# EAGLE design attiny_dev_board (EAGLE 9.6.2)
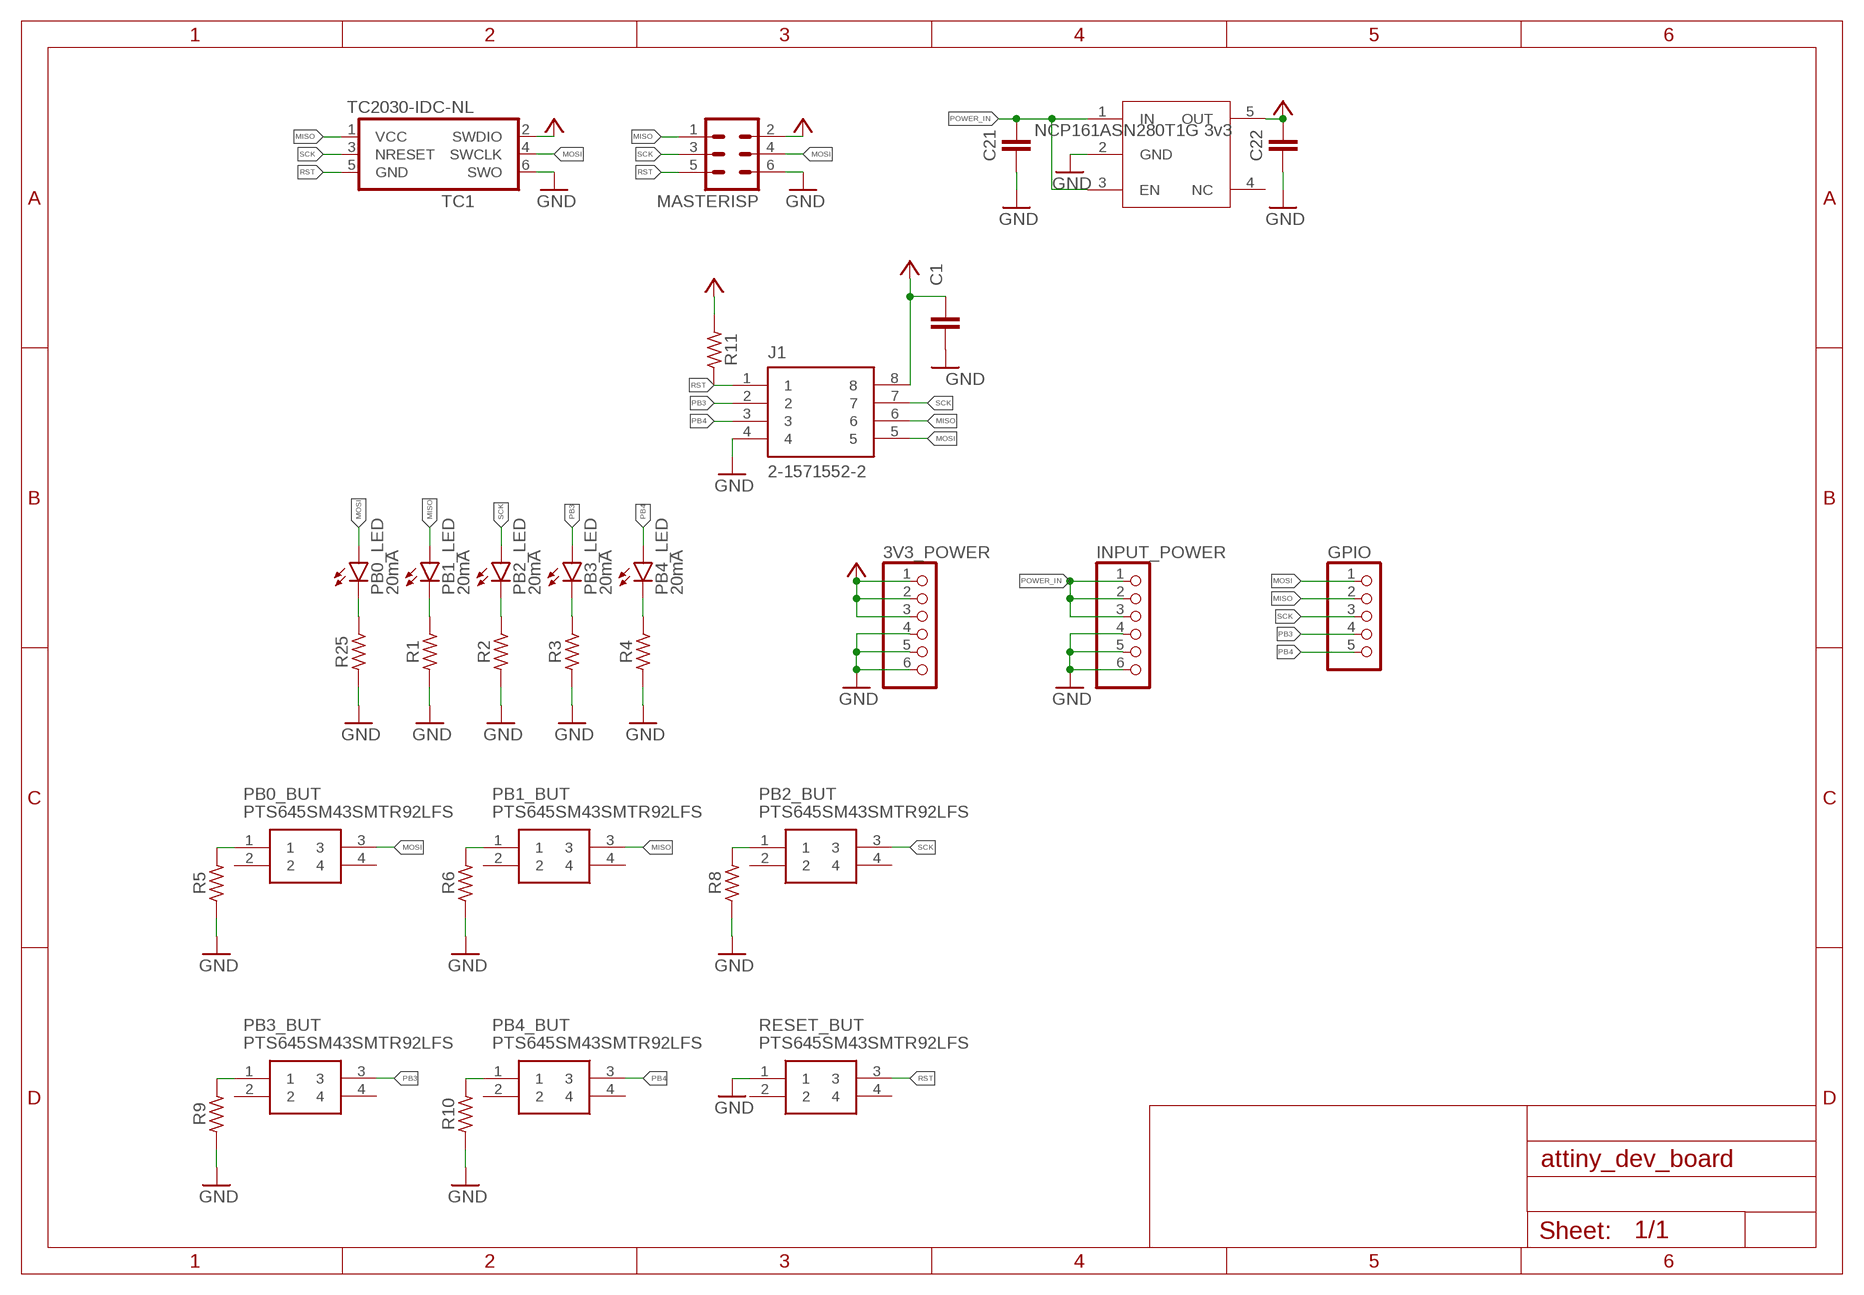
[diagram p0: schematic, sheet 1]

## Parts
3V3_POWER  PINHD-1X6  [1X06]
3V3_REG1  3V3  NCP718BSN330T1G  [NCP718BSN330T1G]
C1  0.1uF  C-EUC0603  [C0603]
C21  1uF  C-EUC0603  [C0603]
C22  1uF  C-EUC0603  [C0603]
GPIO  PINHD-1X5  [1X05]
INPUT_POWER  PINHD-1X6  [1X06]
J1  2-1571552-2  [TE_2-1571552-2]
MASTERISP  5v  MA03-2-3D  [MA03-2]
PB0_BUT  PTS645SM43SMTR92LFS  [PTS645(SMT)]
PB0_LED  20mA  LEDCHIP-LED0603  [CHIP-LED0603]
PB1_BUT  PTS645SM43SMTR92LFS  [PTS645(SMT)]
PB1_LED  20mA  LEDCHIP-LED0603  [CHIP-LED0603]
PB2_BUT  PTS645SM43SMTR92LFS  [PTS645(SMT)]
PB2_LED  20mA  LEDCHIP-LED0603  [CHIP-LED0603]
PB3_BUT  PTS645SM43SMTR92LFS  [PTS645(SMT)]
PB3_LED  20mA  LEDCHIP-LED0603  [CHIP-LED0603]
PB4_BUT  PTS645SM43SMTR92LFS  [PTS645(SMT)]
PB4_LED  20mA  LEDCHIP-LED0603  [CHIP-LED0603]
R1  1k  52101-101-REV-A_RC-MASTER-SMD_R_0603MP  [52101-101-REV-A_RC-MASTER-SMD_R0603MP]
R2  1k  52101-101-REV-A_RC-MASTER-SMD_R_0603MP  [52101-101-REV-A_RC-MASTER-SMD_R0603MP]
R3  1k  52101-101-REV-A_RC-MASTER-SMD_R_0603MP  [52101-101-REV-A_RC-MASTER-SMD_R0603MP]
R4  1k  52101-101-REV-A_RC-MASTER-SMD_R_0603MP  [52101-101-REV-A_RC-MASTER-SMD_R0603MP]
R5  20R  52101-101-REV-A_RC-MASTER-SMD_R_0603MP  [52101-101-REV-A_RC-MASTER-SMD_R0603MP]
R6  20R  52101-101-REV-A_RC-MASTER-SMD_R_0603MP  [52101-101-REV-A_RC-MASTER-SMD_R0603MP]
R8  20R  52101-101-REV-A_RC-MASTER-SMD_R_0603MP  [52101-101-REV-A_RC-MASTER-SMD_R0603MP]
R9  20R  52101-101-REV-A_RC-MASTER-SMD_R_0603MP  [52101-101-REV-A_RC-MASTER-SMD_R0603MP]
R10  20R  52101-101-REV-A_RC-MASTER-SMD_R_0603MP  [52101-101-REV-A_RC-MASTER-SMD_R0603MP]
R11  10K  52101-101-REV-A_RC-MASTER-SMD_R_0603MP  [52101-101-REV-A_RC-MASTER-SMD_R0603MP]
R25  1k  52101-101-REV-A_RC-MASTER-SMD_R_0603MP  [52101-101-REV-A_RC-MASTER-SMD_R0603MP]
RESET_BUT  PTS645SM43SMTR92LFS  [PTS645(SMT)]
TC1  TC2030-IDC-NL  [TC2030-IDC-NL]

## Nets
ACTIVITY_LED1: PB1_LED.C R1.2
ACTIVITY_LED2: PB0_LED.C R25.2
ACTIVITY_LED3: PB2_LED.C R2.2
ACTIVITY_LED4: PB3_LED.C R3.2
ACTIVITY_LED5: PB4_LED.C R4.2
GND: 3V3_POWER.4 3V3_POWER.5 3V3_POWER.6 3V3_REG1.2(GND) C1.2 C21.2 C22.2 INPUT_POWER.4 INPUT_POWER.5 INPUT_POWER.6 J1.4 MASTERISP.6 R1.1 R2.1 R3.1 R4.1 R5.1 R6.1 R8.1 R9.1 R10.1 R25.1 RESET_BUT.1 TC1.6(SWO)
MISO: GPIO.2 J1.6 MASTERISP.1 PB1_BUT.3 PB1_LED.A TC1.1(VCC)
MOSI: GPIO.1 J1.5 MASTERISP.4 PB0_BUT.3 PB0_LED.A TC1.4(SWCLK)
N$1: PB0_BUT.1 R5.2
N$2: PB1_BUT.1 R6.2
N$3: PB2_BUT.1 R8.2
N$4: PB3_BUT.1 R9.2
N$5: PB4_BUT.1 R10.2
PB3: GPIO.4 J1.2 PB3_BUT.3 PB3_LED.A
PB4: GPIO.5 J1.3 PB4_BUT.3 PB4_LED.A
POWER_IN: 3V3_REG1.1(IN) 3V3_REG1.3(EN) C21.1 INPUT_POWER.1 INPUT_POWER.2 INPUT_POWER.3
RST: J1.1 MASTERISP.5 R11.2 RESET_BUT.3 TC1.5(GND)
SCK: GPIO.3 J1.7 MASTERISP.3 PB2_BUT.3 PB2_LED.A TC1.3(NRESET)
VCC: 3V3_POWER.1 3V3_POWER.2 3V3_POWER.3 3V3_REG1.5(OUT) C1.1 C22.1 J1.8 MASTERISP.2 R11.1 TC1.2(SWDIO)
Unconnected: 3V3_REG1.4(NC) PB0_BUT.2 PB0_BUT.4 PB1_BUT.2 PB1_BUT.4 PB2_BUT.2 PB2_BUT.4 PB3_BUT.2 PB3_BUT.4 PB4_BUT.2 PB4_BUT.4 RESET_BUT.2 RESET_BUT.4

## Notes on the sheet
- NCP161ASN280T1G 3v3

## Library data of the parts
3V3_POWER INPUT_POWER = pinhead:PINHD-1X6: PIN HEADER
3V3_REG1 = IC-packages_BIG-pack V1.0:NCP718BSN330T1G
C1 C21 C22 = rcl:C-EU: CAPACITOR, European symbol; SPICEPREFIX: C
GPIO = pinhead:PINHD-1X5: PIN HEADER
J1 = 2-1571552-2:2-1571552-2: Row Spacing 2.54 mm Pitch Through Hole Dip Socket Check prices <https://pricing.snapeda.com/parts/2-1571552-2/TE%20Connectivity/view-part?ref=eda>; AVAILABILITY: Warning; COMMENT: 2-1571552-2; CONTACT_CURRENT_RATING_MAX: 3 A; DESCRIPTION: 8 (2 x 4) Pos DIP, 0.3 (7.62mm) Row Spacing Socket Gold Through Hole; EU_ROHS_COMPLIANCE: Compliant; MF: TE Connectivity; MP: 2-1571552-2; PACKAGE: None; PRICE: None; PRODUCT_TYPE: Socket
MASTERISP = con-lstb:MA03-2-3D: PIN HEADER; OC_FARNELL: unknown; OC_NEWARK: unknown
PB0_BUT PB1_BUT PB2_BUT PB3_BUT PB4_BUT RESET_BUT = PTS645SM43SMTR92LFS:PTS645SM43SMTR92LFS: C & K COMPONENTS - PTS645SM43SMTR92LFS - SWITCH, SPST, 0.05A, 12VDC, SMD, 4.3MM Source: Datasheet <http://www.farnell.com/datasheets/1914518.pdf>; DESCRIPTION: C & K COMPONENTS - PTS645SM43SMTR92LFS - SWITCH, SPST, 0.05A, 12VDC, SMD, 4.3MM; HEIGHT: mm; MANUFACTURER_NAME: C & K COMPONENTS; MANUFACTURER_PART_NUMBER: PTS645SM43SMTR92LFS; MOUSER_PART_NUMBER: 611-PTS645SM43SMTR92; MOUSER_PRICE-STOCK: https://www.mouser.com/Search/Refine.aspx?Keyword=611-PTS645SM43SMTR92
PB0_LED PB1_LED PB2_LED PB3_LED PB4_LED = led:LED: LED OSRAM: - CHIPLED LG R971, LG N971, LY N971, LG Q971, LY Q971, LO R971, LY R971 LH N974, LH R974 LS Q976, LO Q976, LY Q976 LO Q996 - Hyper CHIPLED LW Q18S LB Q993, LB Q99A, LB R99A - SideLED LS A670, LO A670, LY A670, LG A670, LP A670 LB A673, LV A673, LT A673, LW A673 LH A674 LY A675 LS A676, LA A676, LO A676, LY A676, LW A676 LS A679, LY A679, LG A679 - Hyper Micro SIDELED® LS Y876, LA Y876, LO Y876, LY Y876 LT Y87S - SmartLED LW L88C, LW L88S LB L89C, LB L89S, LG L890 LS L89K, LO L89K, LY L89K LS L896, LA L896, LO L896, LY L896 - TOPLED LS T670, LO T670, LY T670, LG T670, LP T670 LSG T670, LSP T670, LSY T670, LOP T670, LYG T670 LG T671, LOG T671, LSG T671 LB T673, LV T673, LT T673, LW T673 LH T674 LS T676, LA T676, LO T676, LY T676, LB T676, LH T676, LSB T676, LW T676 LB T67C, LV T67C, LT T67C, LS T67K, LO T67K, LY T67K, LW E67C LS E67B, LA E67B, LO E67B, LY E67B, LB E67C, LV E67C, LT E67C LW T67C LS T679, LY T679, LG T679 LS T770, LO T770, LY T770, LG T770, LP T770 LB T773, LV T773, LT T773, LW T773 LH T774 LS E675, LA E675, LY E675, LS T675 LS T776, LA T776, LO T776, LY T776, LB T776 LHGB T686 LT T68C, LB T68C - Hyper Mini TOPLED® LB M676 - Mini TOPLED Santana® LG M470 LS M47K, LO M47K, LY M47K Source: http://www.osram.convergy.de LUXEON: - LUMILED® LXK2-PW12-R00, LXK2-PW12-S00, LXK2-PW14-U00, LXK2-PW14-V00 LXK2-PM12-R00, LXK2-PM12-S00, LXK2-PM14-U00 LXK2-PE12-Q00, LXK2-PE12-R00, LXK2-PE12-S00, LXK2-PE14-T00, LXK2-PE14-U00 LXK2-PB12-K00, LXK2-PB12-L00, LXK2-PB12-M00, LXK2-PB14-N00, LXK2-PB14-P00, LXK2-PB14-Q00 LXK2-PR12-L00, LXK2-PR12-M00, LXK2-PR14-Q00, LXK2-PR14-R00 LXK2-PD12-Q00, LXK2-PD12-R00, LXK2-PD12-S00 LXK2-PH12-R00, LXK2-PH12-S00 LXK2-PL12-P00, LXK2-PL12-Q00, LXK2-PL12-R00 Source: www.luxeon.com KINGBRIGHT: KA-3528ASYC Source: www.kingbright.com
R1-R6 R8-R11 R25 = ESP32_DMX_Audio:52101-101-REV-A_RC-MASTER-SMD_R_: RESISTOR
TC1 = TC2030-IDC:TC2030-IDC: Tag-Connect In Circuit Programming & Debug Cable 6 Pin http://www.tag-connect.com Check prices <https://pricing.snapeda.com/parts/TC2030-IDC/Tag-Connect%20LLC/view-part?ref=eda>; AVAILABILITY: Warning; DESCRIPTION: Plug-Of-Nails™ Adapter Cable; MF: Tag-Connect LLC; MP: TC2030-IDC; PACKAGE: None; PRICE: None; PURCHASE-URL: https://pricing.snapeda.com/search/part/TC2030-IDC/?ref=eda

## Board
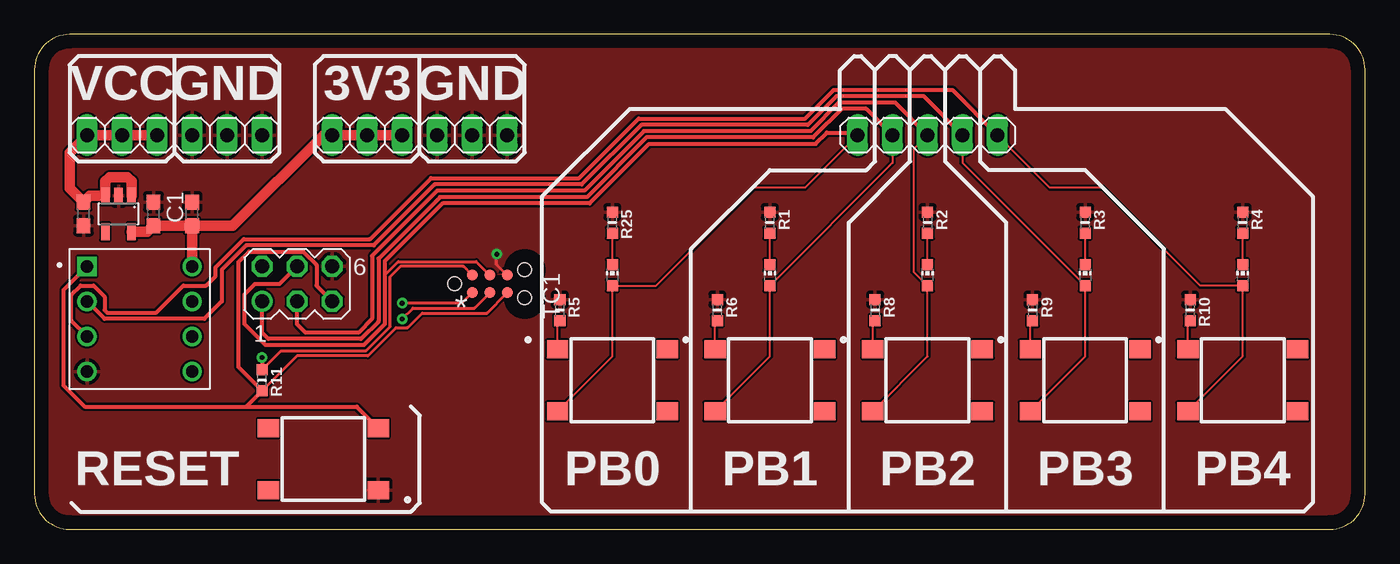
[diagram p1: board, top side]
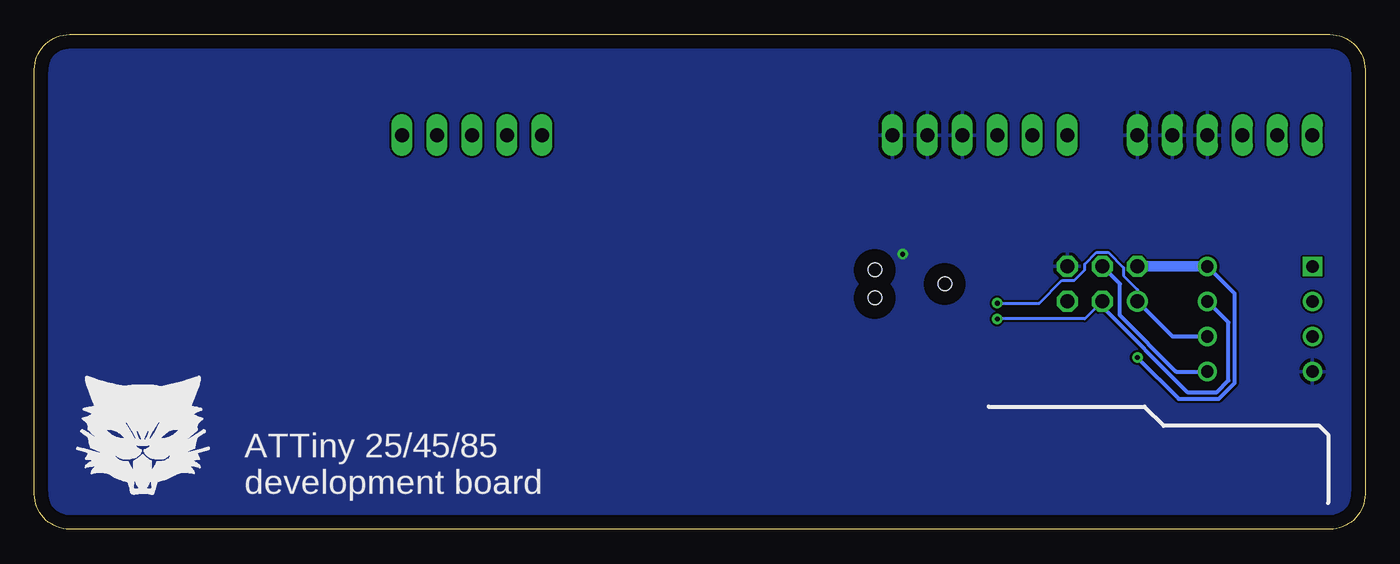
[diagram p2: board, bottom side, seen from below]

Size 96.5 x 35.87 mm. Coordinates in mm from the lower left corner, seen from the top.
Outline: 93.96,35.87 2.54,35.87 arc90 0,33.33 0,2.54 arc90 2.54,0 93.96,0 arc90 96.5,2.54 96.5,33.33 arc90 93.96,35.87
Copper layers (1*16): Top 0.035mm / dielectric 1.5mm / Bottom 0.035mm
Design rules "default": minimum track width 6mil, minimum drill 0.35mm, track to track 6mil, track to pad 6mil, pad to pad 6mil, via to via 6mil, smd to smd 6mil, copper to edge 40mil, drill to drill 6mil, minimum pad ring 10mil, minimum via ring 8mil, stop-mask expansion 4mil, vias tented up to drill 0mil, thermal gap 10mil

### Footprints (pad centres in the part's own frame; a part is rotated, then mirrored left to right if it is on the bottom)
1X06 = drill 1.016 long: 1 -6.35,0; 2 -3.81,0; 3 -1.27,0; 4 1.27,0; 5 3.81,0; 6 6.35,0
NCP718BSN330T1G = smd 0.62 x 1.22: 1 -0.95,-1.3; 2 0,-1.3; 3 0.95,-1.3; 4 0.95,1.3; 5 -0.95,1.3
C0603 = smd 1.1 x 1: 1 -0.85,0; 2 0.85,0
1X05 = drill 1.016 long: 1 -5.08,0; 2 -2.54,0; 3 0,0; 4 2.54,0; 5 5.08,0
TE_2-1571552-2 = drill 0.889 square: 1 -3.81,3.81 | drill 0.889: 2 -3.81,1.27; 3 -3.81,-1.27; 4 -3.81,-3.81; 5 3.81,-3.81; 6 3.81,-1.27; 7 3.81,1.27; 8 3.81,3.81
MA03-2 = drill 1.016: 1 -2.54,-1.27 | drill 1.016 octagon: 2 -2.54,1.27; 3 0,-1.27; 4 0,1.27; 5 2.54,-1.27; 6 2.54,1.27
PTS645(SMT) = smd 1.55 x 1.3: 1 -3.975,2.25; 2 3.975,2.25; 3 -3.975,-2.25; 4 3.975,-2.25
CHIP-LED0603 = smd 0.8 x 0.8: A 0,-0.75; C 0,0.75
52101-101-REV-A_RC-MASTER-SMD_R0603MP = smd 0.8 x 0.8: 1 -0.762,0; 2 0.762,0
TC2030-IDC-NL = smd 0.787 x 0.787: 1 -1.27,-0.635; 2 -1.27,0.635; 3 0,-0.635; 4 0,0.635; 5 1.27,-0.635; 6 1.27,0.635 | hole 0.991: -2.54,0; 2.54,1.016; 2.54,-1.016

### Placement (x,y rotation side)
3V3_POWER  27.94,28.57 0 top
3V3_REG1  6.1,22.86 180 top
C1  11.43,22.86 90 top
C21  3.56,22.86 270 top
C22  8.64,22.86 90 top
GPIO  64.77,28.57 0 top
INPUT_POWER  10.16,28.57 0 top
J1  7.62,15.24 0 top
MASTERISP  19.05,17.78 0 top
PB0_BUT  41.91,10.79 0 top
PB0_LED  41.91,18.41 0 top
PB1_BUT  53.34,10.79 0 top
PB1_LED  53.34,18.41 0 top
PB2_BUT  64.77,10.79 0 top
PB2_LED  64.77,18.41 0 top
PB3_BUT  76.2,10.79 0 top
PB3_LED  76.2,18.41 0 top
PB4_BUT  87.63,10.79 0 top
PB4_LED  87.63,18.41 0 top
R1  53.34,22.23 270 top
R2  64.77,22.23 270 top
R3  76.2,22.23 270 top
R4  87.63,22.23 270 top
R5  38.1,15.88 270 top
R6  49.53,15.88 270 top
R8  60.96,15.88 270 top
R9  72.39,15.88 270 top
R10  83.82,15.88 270 top
R11  16.51,10.79 270 top
R25  41.91,22.23 270 top
RESET_BUT  20.95,5.08 180 top
TC1  33.02,17.78 0 top

### Tracks (layer width: path | path; a pad name or v marks a point on that pad's centre or on a via)
ACTIVITY_LED1
  Top 0.152: PB1_LED.C R1.2
ACTIVITY_LED2
  Top 0.152: PB0_LED.C R25.2
ACTIVITY_LED3
  Top 0.152: PB2_LED.C R2.2
ACTIVITY_LED4
  Top 0.152: PB3_LED.C R3.2
ACTIVITY_LED5
  Top 0.152: PB4_LED.C R4.2
GND  (via drill 0.35)
  Top 0.203: TC1.6 33.53,19.18 v33.53,19.94
  pour Top: -5.08,40.01 99.06,40.01 99.06,-2.54 -5.08,-2.54
  pour Bottom: -5.08,40.01 99.06,40.01 101.6,37.47 101.6,0 99.06,-2.54 -5.08,-2.54
MISO  (via drill 0.35)
  Top 0.152: PB1_BUT.3 53.34,12.52 PB1_LED.A 62.23,26.55 GPIO.2
  Top 0.203: TC1.1 30.99,16.38 v26.67,16.38
  Top 0.305: MASTERISP.1 16.51,14.24 16.95,13.79 23.69,13.79 24.94,15.05 24.94,19.62 29.4,24.08 40.07,24.08 44.39,28.4 56.46,28.4 58.55,30.48 60.33,30.48 GPIO.2
  Bottom 0.203: v26.67,16.38 23.62,16.38 21.97,18.03 21.08,18.03 20.32,18.8 20.32,19.22 19.47,20.07 18.63,20.07 17.53,18.96 17.53,18.38 16.51,17.36 MASTERISP.1
  Bottom 0.305: MASTERISP.1 13.97,13.97 J1.6
MOSI
  Top 0.152: PB0_BUT.3 41.91,12.52 PB0_LED.A 45.09,17.66 52.19,24.77 55.88,24.77 GPIO.1
  Top 0.203: 25.4,18.41 26.39,19.41 32.03,19.41 TC1.4
  Top 0.305: MASTERISP.4 17.78,17.78 16,17.78 15.24,17.02 15.24,14.86 16.76,13.34 23.88,13.34 25.4,14.86 25.4,18.41 25.4,19.43 29.59,23.62 40.26,23.62 44.58,27.94 56.65,27.94 57.47,28.75 59.05,28.75 59.23,28.57 GPIO.1
  Bottom 0.305: MASTERISP.4 17.78,17.78 17.78,15.49 13.72,11.43 J1.5
N$1
  Top 0.152: PB0_BUT.1 37.94,14.95 R5.2
N$2
  Top 0.152: PB1_BUT.1 49.37,14.95 R6.2
N$3
  Top 0.152: PB2_BUT.1 60.8,14.95 R8.2
N$4
  Top 0.152: PB3_BUT.1 72.22,14.95 R9.2
N$5
  Top 0.152: PB4_BUT.1 83.66,14.95 R10.2
PB3
  Top 0.152: PB3_BUT.3 76.2,12.52 PB3_LED.A 67.31,26.55 GPIO.4
  Top 0.305: GPIO.4 64.49,31.39 58.17,31.39 56.09,29.31 44.01,29.31 39.69,24.99 29.02,24.99 24.6,20.57 15.37,20.57 13.59,18.8 13.59,16.51 12.32,15.24 5.08,15.24 J1.2
PB4
  Top 0.152: PB4_BUT.3 87.63,12.52 PB4_LED.A 84.57,17.66 77.47,24.77 73.66,24.77 GPIO.5
  Top 0.305: GPIO.5 66.57,31.85 57.98,31.85 55.9,29.77 43.82,29.77 39.5,25.45 28.75,25.45 24.33,21.03 15.18,21.03 13.13,18.98 13.13,18.34 12.45,17.65 10.79,17.65 8.84,15.7 5.27,15.7 5.08,15.89 5.08,16.86 4.28,17.65 3.34,17.65 2.67,16.98 2.67,15.11 J1.3
POWER_IN
  Top 0.762: INPUT_POWER.3 INPUT_POWER.2 INPUT_POWER.1 2.54,27.3 2.54,24.73 C21.1 4.01,24.16 3V3_REG1.3 5.15,25.21 5.46,25.53 6.73,25.53 7.05,25.21 3V3_REG1.1
RST
  Top 0.203: TC1.5 32.82,15.67 28.12,15.67 27.05,14.61 26.22,14.61 24.19,12.57 19.05,12.57 R11.2
  Top 0.305: MASTERISP.5 20.45,17.65 20.45,19.16 19.49,20.12 15.56,20.12 14.78,19.34 14.78,11.76 R11.2 15.37,8.89 | RESET_BUT.3 23.37,8.89 15.37,8.89 | 15.37,8.89 3.63,8.89 2.11,10.41 2.11,17.35 J1.1
SCK  (via drill 0.35)
  Top 0.152: PB2_BUT.3 64.77,12.52 PB2_LED.A 63.75,18.68 63.75,27.56 GPIO.3
  Top 0.203: v26.67,15.24 27.46,16.03 31.9,16.03 32.92,17.04 | 32.92,17.04 33.02,17.04 | TC1.3 32.92,17.04
  Top 0.305: MASTERISP.3 19.05,14.86 19.66,14.25 23.5,14.25 24.49,15.24 24.49,19.81 29.21,24.54 39.88,24.54 44.2,28.85 56.27,28.85 58.36,30.94 62.41,30.94 GPIO.3
  Bottom 0.203: MASTERISP.3 20.32,15.24 v26.67,15.24
  Bottom 0.305: MASTERISP.3 19.05,16.12 12.84,9.91 10.79,9.91 9.91,10.79 9.91,14.99 J1.7
VCC  (via drill 0.35)
  Top 0.203: TC1.2 31.11,19.05 26.54,19.05 25.81,18.31 25.81,14.69 24.04,12.93 17.88,12.93 R11.1
  Top 0.305: v16.51,12.45 R11.1
  Top 0.762: 3V3_POWER.3 3V3_POWER.2 3V3_POWER.1 20.95,28.57 14.39,22.01 C1.1 | 3V3_REG1.5 8.19,21.56 C22.1 C1.1 | C1.1 J1.8
  Bottom 0.305: v16.51,12.45 13.51,9.45 10.61,9.45 9.45,10.61 9.45,17.07 J1.8
  Bottom 0.762: J1.8 MASTERISP.2

### Text on the board
tPlace: VCC | GND | 3V3 | GND | * | RESET | PB0 | PB1 | PB2 | PB3 | PB4
bPlace: ATTiny 25/45/85 / development board